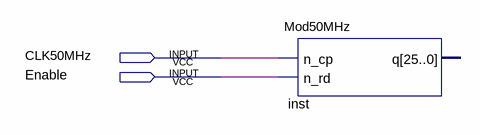
[diagram p0: schematic sheet]
// Quartus schematic Clock.bdf as structural Verilog: 1 symbols, 2 pins
module Clock (
  input  CLK50MHz,
  input  Enable
);

  Mod50MHz inst (.n_cp(CLK50MHz), .n_rd(Enable));  // open: q
endmodule
